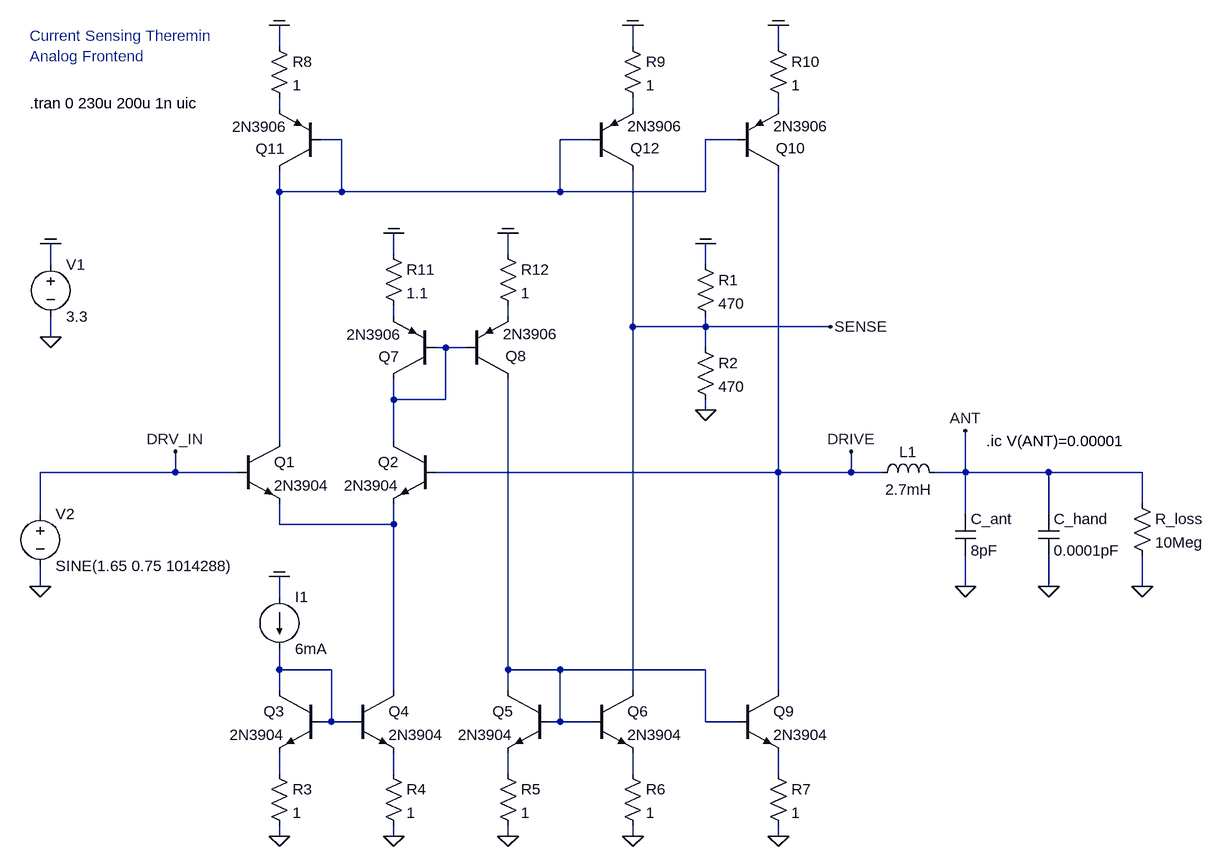
[diagram p0: schematic 2023_03_bjt_trans_cond_volt_follower_current_sensing_buffer_v01.asc]
2023_03_bjt_trans_cond_volt_follower_current_sensing_buffer_v01.asc, the LTspice schematic file:
Version 4
SHEET 1 16292 17284
WIRE 6320 10496 6320 10464
WIRE 6864 10496 6864 10464
WIRE 7088 10496 7088 10464
WIRE 6320 10592 6320 10576
WIRE 6864 10592 6864 10576
WIRE 7088 10592 7088 10576
WIRE 6416 10640 6384 10640
WIRE 6800 10640 6752 10640
WIRE 7024 10640 6976 10640
WIRE 6320 10720 6320 10688
WIRE 6416 10720 6416 10640
WIRE 6416 10720 6320 10720
WIRE 6752 10720 6752 10640
WIRE 6752 10720 6416 10720
WIRE 6976 10720 6976 10640
WIRE 6976 10720 6752 10720
WIRE 6496 10816 6496 10784
WIRE 6672 10816 6672 10784
WIRE 5968 10832 5968 10800
WIRE 6976 10832 6976 10800
WIRE 6496 10912 6496 10896
WIRE 6672 10912 6672 10896
WIRE 6864 10928 6864 10688
WIRE 6976 10928 6976 10912
WIRE 6976 10928 6864 10928
WIRE 7168 10928 6976 10928
WIRE 5968 10944 5968 10912
WIRE 6576 10960 6560 10960
WIRE 6608 10960 6576 10960
WIRE 6976 10960 6976 10928
WIRE 6496 11040 6496 11008
WIRE 6576 11040 6576 10960
WIRE 6576 11040 6496 11040
WIRE 6976 11056 6976 11040
WIRE 6320 11104 6320 10720
WIRE 6496 11104 6496 11040
WIRE 6160 11152 6160 11120
WIRE 6160 11152 5952 11152
WIRE 6256 11152 6160 11152
WIRE 7088 11152 7088 10688
WIRE 7088 11152 6560 11152
WIRE 7200 11152 7200 11120
WIRE 7200 11152 7088 11152
WIRE 7248 11152 7200 11152
WIRE 7376 11152 7376 11088
WIRE 7376 11152 7328 11152
WIRE 7504 11152 7376 11152
WIRE 7648 11152 7504 11152
WIRE 7648 11200 7648 11152
WIRE 5952 11216 5952 11152
WIRE 7376 11216 7376 11152
WIRE 7504 11216 7504 11152
WIRE 6320 11232 6320 11200
WIRE 6496 11232 6496 11200
WIRE 6496 11232 6320 11232
WIRE 5952 11328 5952 11296
WIRE 7376 11328 7376 11280
WIRE 7504 11328 7504 11280
WIRE 7648 11328 7648 11280
WIRE 6320 11344 6320 11312
WIRE 6320 11456 6320 11424
WIRE 6400 11456 6320 11456
WIRE 6672 11456 6672 11008
WIRE 6752 11456 6672 11456
WIRE 6976 11456 6752 11456
WIRE 6320 11488 6320 11456
WIRE 6496 11488 6496 11232
WIRE 6672 11488 6672 11456
WIRE 6864 11488 6864 10928
WIRE 7088 11488 7088 11152
WIRE 6400 11536 6400 11456
WIRE 6400 11536 6384 11536
WIRE 6432 11536 6400 11536
WIRE 6752 11536 6752 11456
WIRE 6752 11536 6736 11536
WIRE 6800 11536 6752 11536
WIRE 6976 11536 6976 11456
WIRE 7024 11536 6976 11536
WIRE 6320 11616 6320 11584
WIRE 6496 11616 6496 11584
WIRE 6672 11616 6672 11584
WIRE 6864 11616 6864 11584
WIRE 7088 11616 7088 11584
WIRE 6320 11712 6320 11696
WIRE 6496 11712 6496 11696
WIRE 6672 11712 6672 11696
WIRE 6864 11712 6864 11696
WIRE 7088 11712 7088 11696
FLAG 5968 10944 0
FLAG 5968 10800 COM
FLAG 6496 11712 0
FLAG 6320 11712 0
FLAG 6320 11312 COM
FLAG 6672 10784 COM
FLAG 6496 10784 COM
FLAG 7088 11712 0
FLAG 6672 11712 0
FLAG 7376 11328 0
FLAG 7376 11088 ANT
FLAG 7504 11328 0
FLAG 7648 11328 0
FLAG 7200 11120 DRIVE
FLAG 7088 10464 COM
FLAG 6320 10464 COM
FLAG 5952 11328 0
FLAG 6864 11712 0
FLAG 6864 10464 COM
FLAG 6976 10800 COM
FLAG 6976 11056 0
FLAG 7168 10928 SENSE
FLAG 6160 11120 DRV_IN
SYMBOL voltage 5968 10816 R0
WINDOW 123 0 0 Left 0
WINDOW 39 0 0 Left 0
SYMATTR InstName V1
SYMATTR Value 3.3
SYMBOL npn 6256 11104 R0
SYMATTR InstName Q1
SYMATTR Value 2N3904
SYMBOL npn 6560 11104 M0
SYMATTR InstName Q2
SYMATTR Value 2N3904
SYMBOL npn 6432 11488 R0
SYMATTR InstName Q4
SYMATTR Value 2N3904
SYMBOL npn 6384 11488 M0
SYMATTR InstName Q3
SYMATTR Value 2N3904
SYMBOL res 6304 11600 R0
WINDOW 0 36 40 Left 2
WINDOW 3 36 76 Left 2
SYMATTR InstName R3
SYMATTR Value 1
SYMBOL res 6480 11600 R0
WINDOW 0 36 40 Left 2
WINDOW 3 36 76 Left 2
SYMATTR InstName R4
SYMATTR Value 1
SYMBOL current 6320 11344 R0
WINDOW 123 0 0 Left 0
WINDOW 39 0 0 Left 0
SYMATTR InstName I1
SYMATTR Value 6mA
SYMBOL pnp 6608 11008 M180
WINDOW 0 60 35 Left 2
WINDOW 3 56 69 Left 2
SYMATTR InstName Q8
SYMATTR Value 2N3906
SYMBOL res 6656 10800 R0
WINDOW 0 36 40 Left 2
WINDOW 3 36 76 Left 2
SYMATTR InstName R12
SYMATTR Value 1
SYMBOL pnp 6560 11008 R180
WINDOW 0 55 34 Left 2
WINDOW 3 52 68 Left 2
SYMATTR InstName Q7
SYMATTR Value 2N3906
SYMBOL res 6480 10800 R0
WINDOW 0 36 40 Left 2
WINDOW 3 36 76 Left 2
SYMATTR InstName R11
SYMATTR Value 1.1
SYMBOL npn 7024 11488 R0
SYMATTR InstName Q9
SYMATTR Value 2N3904
SYMBOL res 7072 11600 R0
WINDOW 0 36 40 Left 2
WINDOW 3 36 76 Left 2
SYMATTR InstName R7
SYMATTR Value 1
SYMBOL npn 6736 11488 M0
SYMATTR InstName Q5
SYMATTR Value 2N3904
SYMBOL res 6656 11600 R0
WINDOW 0 36 40 Left 2
WINDOW 3 36 76 Left 2
SYMATTR InstName R5
SYMATTR Value 1
SYMBOL cap 7360 11216 R0
SYMATTR InstName C_ant
SYMATTR Value 8pF
SYMBOL cap 7488 11216 R0
SYMATTR InstName C_hand
SYMATTR Value 0.0001pF
SYMBOL res 7632 11184 R0
WINDOW 0 36 40 Left 2
WINDOW 3 36 76 Left 2
SYMATTR InstName R_loss
SYMATTR Value 10Meg
SYMBOL ind 7232 11168 R270
WINDOW 0 32 56 VTop 2
WINDOW 3 5 56 VBottom 2
SYMATTR InstName L1
SYMATTR Value 2.7mH
SYMATTR SpiceLine Ipk=0.5 Rser=120 Cpar=1.1pF
SYMBOL pnp 7024 10688 M180
WINDOW 0 60 35 Left 2
WINDOW 3 56 69 Left 2
SYMATTR InstName Q10
SYMATTR Value 2N3906
SYMBOL res 7072 10480 R0
WINDOW 0 36 40 Left 2
WINDOW 3 36 76 Left 2
SYMATTR InstName R10
SYMATTR Value 1
SYMBOL pnp 6384 10688 R180
WINDOW 0 55 34 Left 2
WINDOW 3 52 68 Left 2
SYMATTR InstName Q11
SYMATTR Value 2N3906
SYMBOL res 6304 10480 R0
WINDOW 0 36 40 Left 2
WINDOW 3 36 76 Left 2
SYMATTR InstName R8
SYMATTR Value 1
SYMBOL voltage 5952 11200 R0
WINDOW 123 0 0 Left 0
WINDOW 39 0 0 Left 0
SYMATTR InstName V2
SYMATTR Value SINE(1.65 0.75 1014288)
SYMBOL npn 6800 11488 R0
SYMATTR InstName Q6
SYMATTR Value 2N3904
SYMBOL res 6848 11600 R0
WINDOW 0 36 40 Left 2
WINDOW 3 36 76 Left 2
SYMATTR InstName R6
SYMATTR Value 1
SYMBOL pnp 6800 10688 M180
WINDOW 0 60 35 Left 2
WINDOW 3 56 69 Left 2
SYMATTR InstName Q12
SYMATTR Value 2N3906
SYMBOL res 6848 10480 R0
WINDOW 0 36 40 Left 2
WINDOW 3 36 76 Left 2
SYMATTR InstName R9
SYMATTR Value 1
SYMBOL res 6960 10816 R0
WINDOW 0 36 40 Left 2
WINDOW 3 36 76 Left 2
SYMATTR InstName R1
SYMATTR Value 470
SYMBOL res 6960 10944 R0
WINDOW 0 36 40 Left 2
WINDOW 3 36 76 Left 2
SYMATTR InstName R2
SYMATTR Value 470
TEXT 5936 10584 Left 2 !.tran 0 230u 200u 1n uic
TEXT 5936 10480 Left 2 ;Current Sensing Theremin \nAnalog Frontend
TEXT 7408 11104 Left 2 !.ic V(ANT)=0.00001

The netlist it stands for:
* 2023_03_bjt_trans_cond_volt_follower_current_sensing_buffer_v01.asc
V1 COM 0 3.3
Q1 N004 DRV_IN N008 0 2N3904
Q2 N007 DRIVE N008 0 2N3904
Q4 N008 N009 N012 0 2N3904
Q3 N009 N009 N011 0 2N3904
R3 N011 0 1
R4 N012 0 1
I1 COM N009 6mA
Q8 N010 N007 N006 0 2N3906
R12 COM N006 1
Q7 N007 N007 N005 0 2N3906
R11 COM N005 1.1
Q9 DRIVE N010 N015 0 2N3904
R7 N015 0 1
Q5 N010 N010 N013 0 2N3904
R5 N013 0 1
C_ant ANT 0 8pF
C_hand ANT 0 0.0001pF
R_loss ANT 0 10Meg
L1 DRIVE ANT 2.7mH Ipk=0.5 Rser=120 Cpar=1.1pF
Q10 DRIVE N004 N003 0 2N3906
R10 COM N003 1
Q11 N004 N004 N001 0 2N3906
R8 COM N001 1
V2 DRV_IN 0 SINE(1.65 0.75 1014288)
Q6 SENSE N010 N014 0 2N3904
R6 N014 0 1
Q12 SENSE N004 N002 0 2N3906
R9 COM N002 1
R1 COM SENSE 470
R2 SENSE 0 470
.model NPN NPN
.model PNP PNP
.lib standard.bjt
.tran 0 230u 200u 1n uic
* Current Sensing Theremin
* Analog Frontend
.ic V(ANT)=0.00001
.backanno
.end